# EAGLE design femto (EAGLE 6.4)
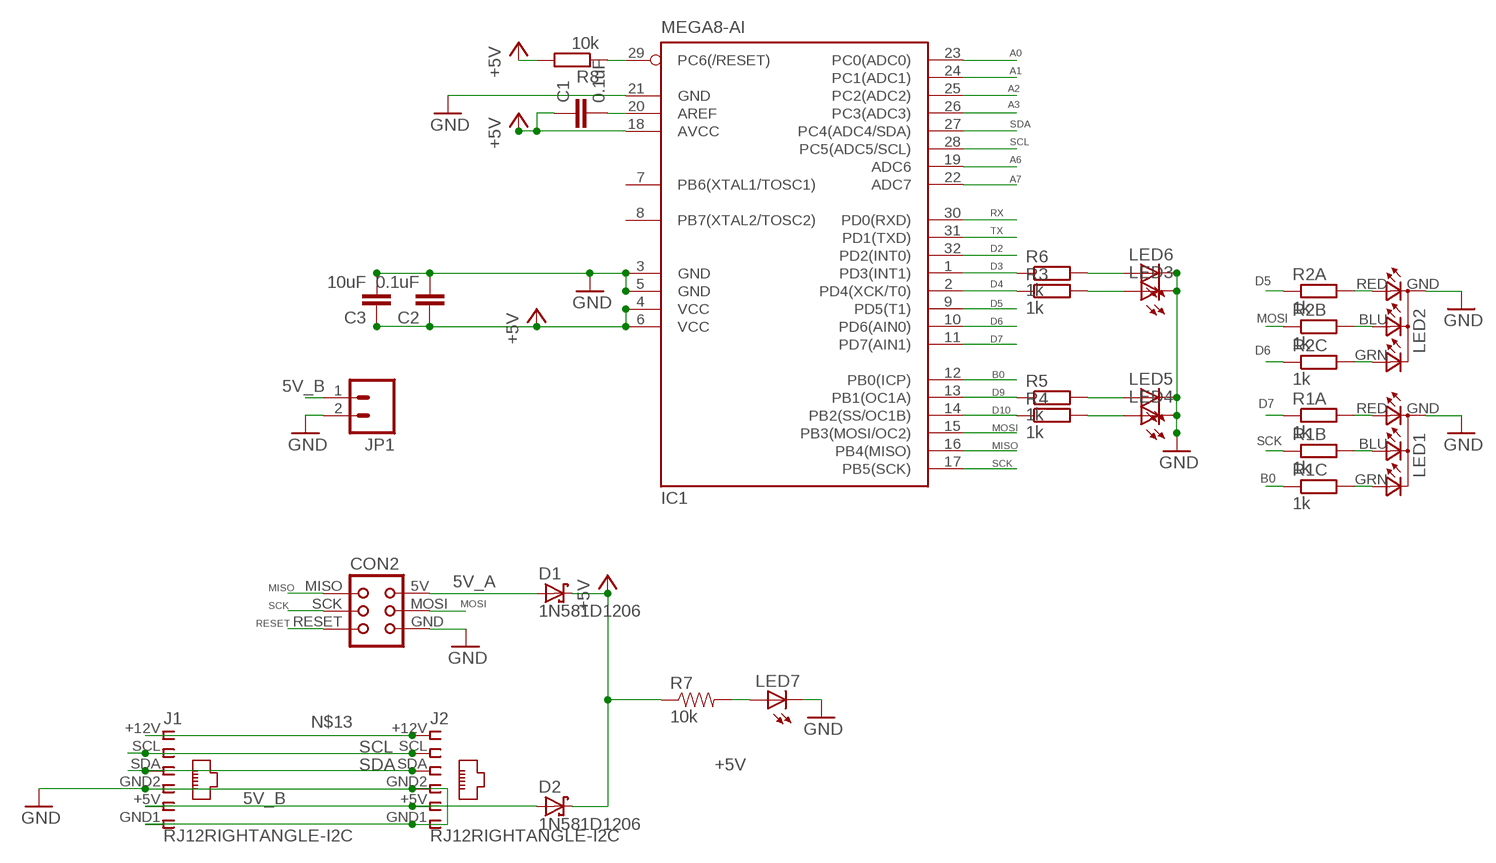
[diagram p0: schematic, sheet 1]

## Parts
C1  0.1uF  C-EUC1206  [C1206]
C2  0.1uF  C-EUC1206  [C1206]
C3  10uF  C-EUC1206  [C1206]
CON2  TINYISPTAG  [TC2030-MCP]
D1  1N581D1206  [LED-1206]
D2  1N581D1206  [LED-1206]
IC1  MEGA8-AI  [TQFP32-08]
J1  RJ12RIGHTANGLE-I2C  [RJ12-RIGHTANGLE-I2C]
J2  RJ12RIGHTANGLE-I2C  [RJ12-RIGHTANGLE-I2C]
JP1  M023.5MM  [SCREWTERMINAL-3.5MM-2]
LED1  RGB-COMMON-CATHODE  [LED-TRICOLOR-THROUGHHOLE]
LED2  RGB-COMMON-CATHODE  [LED-TRICOLOR-THROUGHHOLE]
LED3  LED3MM  [LED3MM]
LED4  LED3MM  [LED3MM]
LED5  LED3MM  [LED3MM]
LED6  LED3MM  [LED3MM]
LED7  LEDCHIP-LED0603  [CHIP-LED0603]
R1A  1k  R-EU_M1206  [M1206]
R1B  1k  R-EU_M1206  [M1206]
R1C  1k  R-EU_M1206  [M1206]
R2A  1k  R-EU_M1206  [M1206]
R2B  1k  R-EU_M1206  [M1206]
R2C  1k  R-EU_M1206  [M1206]
R3  1k  R-EU_M1206  [M1206]
R4  1k  R-EU_M1206  [M1206]
R5  1k  R-EU_M1206  [M1206]
R6  1k  R-EU_M1206  [M1206]
R7  10k  RESISTOR0603-RES  [0603-RES]
R8  10k  R-EU_M1206  [M1206]

## Nets
5V_A [i2c]: CON2.5V(VCC) D1.A
5V_B [power]: D2.A J1.+5V J2.+5V JP1.1
+5V [power]: C1.1 C2.1 C3.1 D1.C D2.C IC1.4(VCC) IC1.6(VCC) IC1.18(AVCC) R7.1 R8.2
A0: IC1.23(PC0(ADC0))
A1: IC1.24(PC1(ADC1))
A2: IC1.25(PC2(ADC2))
A3: IC1.26(PC3(ADC3))
A6: IC1.19(ADC6)
A7: IC1.22(ADC7)
B0: IC1.12(PB0(ICP)) R1C.1
D2: IC1.32(PD2(INT0))
D3: IC1.1(PD3(INT1)) R6.1
D4: IC1.2(PD4(XCK/T0)) R3.1
D5: IC1.9(PD5(T1)) R2A.1
D6: IC1.10(PD6(AIN0)) R2C.1
D7: IC1.11(PD7(AIN1)) R1A.1
D9: IC1.13(PB1(OC1A)) R5.1
D10: IC1.14(PB2(SS/OC1B)) R4.1
GND [power]: C2.2 C3.2 CON2.GND IC1.3(GND) IC1.5(GND) IC1.21(GND) J1.GND1 J1.GND2 J2.GND1 J2.GND2 JP1.2 LED1.GND(A2) LED2.GND(A2) LED3.K(C) LED4.K(C) LED5.K(C) LED6.K(C) LED7.C
MISO: CON2.MISO IC1.16(PB4(MISO))
MOSI: CON2.MOSI IC1.15(PB3(MOSI/OC2)) R2B.1
N$1: LED2.RED(CRED) R2A.2
N$4: C1.2 IC1.20(AREF)
N$7: LED2.BLU(CBLUE) R2B.2
N$8: LED2.GRN(CGREEN) R2C.2
N$13: J1.+12V J2.+12V
N$15: LED7.A R7.2
N$16: LED3.A R3.2
N$20: LED1.RED(CRED) R1A.2
N$21: LED1.BLU(CBLUE) R1B.2
N$22: LED1.GRN(CGREEN) R1C.2
N$23: LED6.A R6.2
N$40: LED5.A R5.2
N$41: LED4.A R4.2
RESET: CON2.RESET IC1.29(PC6(/RESET)) R8.1
RX: IC1.30(PD0(RXD))
SCK: CON2.SCK IC1.17(PB5(SCK)) R1B.1
SCL [i2c]: IC1.28(PC5(ADC5/SCL)) J1.SCL J2.SCL
SDA [i2c]: IC1.27(PC4(ADC4/SDA)) J1.SDA J2.SDA
TX: IC1.31(PD1(TXD))
Unconnected: IC1.7(PB6(XTAL1/TOSC1)) IC1.8(PB7(XTAL2/TOSC2))

## Library data of the parts
C1-C3 = resistor:C-EU: CAPACITOR, European symbol
CON2 = lpatiny:TINYISP: CONNECTOR
D1 D2 = lpatiny:1N581*: 1.0A SCHOTTKY BARRIER RECTIFIER Source: http://www.diodes.com/datasheets/ds23001.pdf
IC1 = atmel:MEGA8: MICROCONTROLLER 8 Kbytes FLASH, 1 kbytes SRAM, 512 bytes EEPROM, USART, 6-channel 10 bit ADC, 2-channel 8 bit ADC Pin compatible with Atmega48, ATMega88, ATMega168 Source: avr.lbr; MPN: ATMEGA8-16AU; OC_FARNELL: 9171371; OC_NEWARK: 73M8863
J1 J2 = lpatiny:RJ12: CORCOM Modular RJ Jacks No Shield Source: www.tycoelectronics.com .. ENG_DS_1654001_1099_RJ_L_0507.pdf
JP1 = SparkFun:M02: Header 2 Standard 2-pin 0.1" header. Use with straight break away headers (SKU : PRT-00116), right angle break away headers (PRT-00553), swiss pins (PRT-00743), machine pins (PRT-00117), and female headers (PRT-00115). Molex polarized connector foot print use with SKU : PRT-08233 with associated crimp pins and housings.
LED1 LED2 = lpatiny:RGB-COMMON-CATHODE
LED3-LED6 = lpatiny:LED3MM
LED7 = adafruit:LED: LED OSRAM: - CHIPLED LG R971, LG N971, LY N971, LG Q971, LY Q971, LO R971, LY R971 LH N974, LH R974 LS Q976, LO Q976, LY Q976 LO Q996 - Hyper CHIPLED LW Q18S LB Q993, LB Q99A, LB R99A - SideLED LS A670, LO A670, LY A670, LG A670, LP A670 LB A673, LV A673, LT A673, LW A673 LH A674 LY A675 LS A676, LA A676, LO A676, LY A676, LW A676 LS A679, LY A679, LG A679 - Hyper Micro SIDELED® LS Y876, LA Y876, LO Y876, LY Y876 LT Y87S - SmartLED LW L88C, LW L88S LB L89C, LB L89S, LG L890 LS L89K, LO L89K, LY L89K LS L896, LA L896, LO L896, LY L896 - TOPLED LS T670, LO T670, LY T670, LG T670, LP T670 LSG T670, LSP T670, LSY T670, LOP T670, LYG T670 LG T671, LOG T671, LSG T671 LB T673, LV T673, LT T673, LW T673 LH T674 LS T676, LA T676, LO T676, LY T676, LB T676, LH T676, LSB T676, LW T676 LB T67C, LV T67C, LT T67C, LS T67K, LO T67K, LY T67K, LW E67C LS E67B, LA E67B, LO E67B, LY E67B, LB E67C, LV E67C, LT E67C LW T67C LS T679, LY T679, LG T679 LS T770, LO T770, LY T770, LG T770, LP T770 LB T773, LV T773, LT T773, LW T773 LH T774 LS E675, LA E675, LY E675, LS T675 LS T776, LA T776, LO T776, LY T776, LB T776 LHGB T686 LT T68C, LB T68C - Hyper Mini TOPLED® LB M676 - Mini TOPLED Santana® LG M470 LS M47K, LO M47K, LY M47K Source: http://www.osram.convergy.de/
R1A R1B R1C R2A R2B R2C R3-R6 R8 = resistor:R-EU_: RESISTOR, European symbol
R7 = SparkFun:RESISTOR: Resistor Basic schematic elements and footprints for 0603, 1206, and PTH resistors.

## Net classes
0 default: width 0.203 mm
1 power: width 0.457 mm
2 i2c: width 0.305 mm
3 fine: width 0.305 mm

## Board
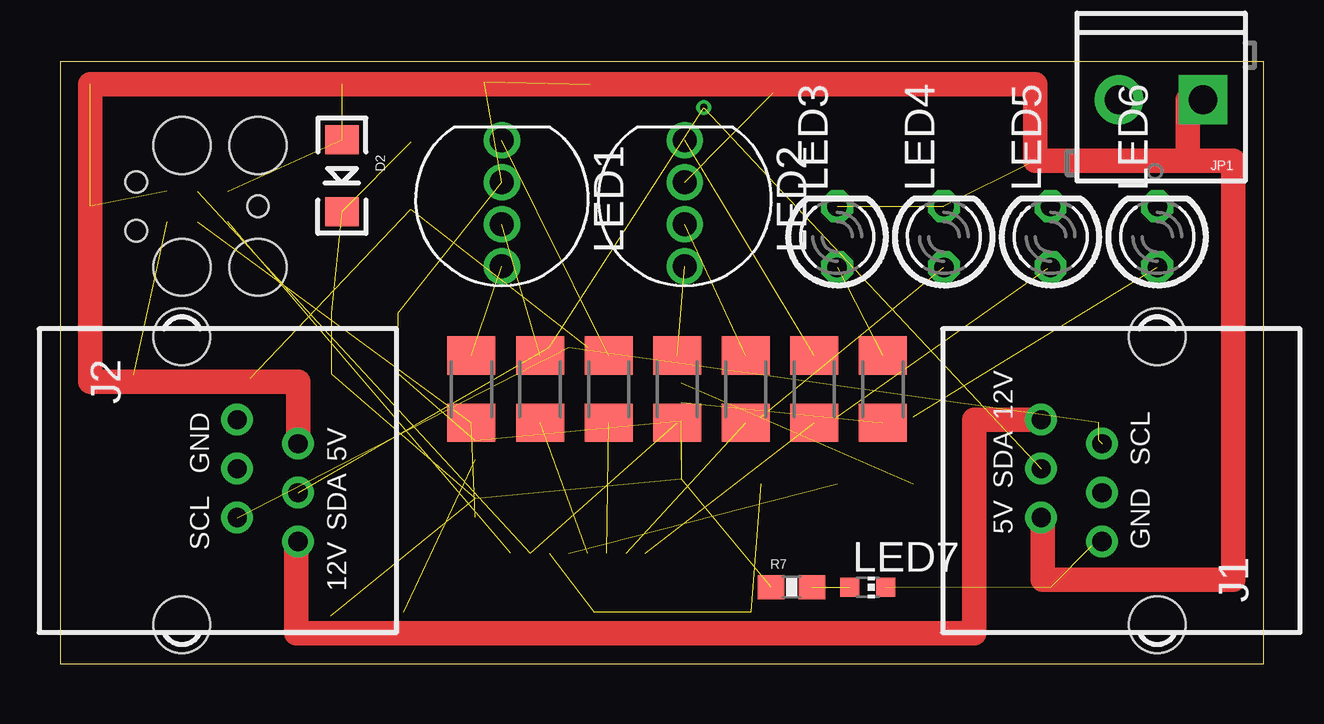
[diagram p1: board, top side]
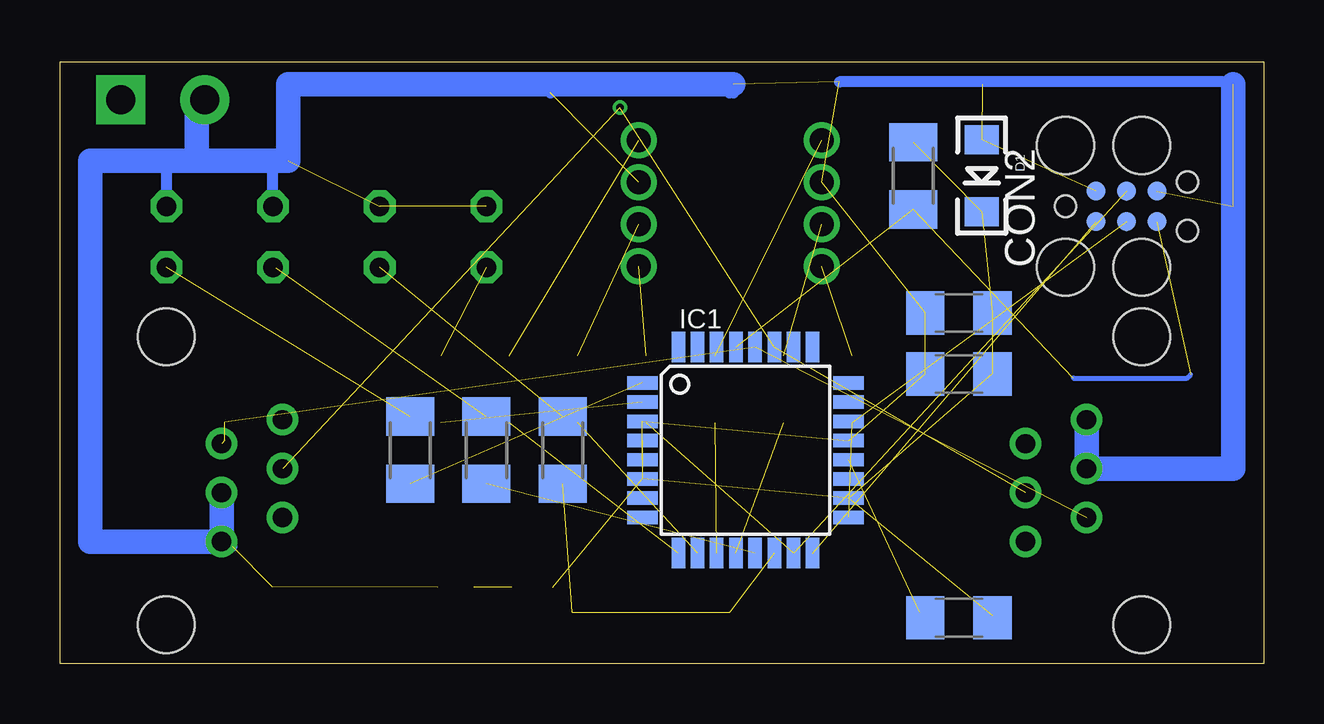
[diagram p2: board, bottom side, seen from below]

Size 50.15 x 25.07 mm. Coordinates in mm from the lower left corner, seen from the top.
Outline: 0,0 50.15,0 50.15,25.07 0,25.07 0,0
Copper layers (1*16): Top 0.035mm / dielectric 1.5mm / Bottom 0.035mm
Design rules: minimum track width 6mil, minimum drill 12mil, track to track 6mil, track to pad 6mil, pad to pad 6mil, via to via 6mil, smd to smd 0mil, copper to edge 10mil, drill to drill 10mil, minimum pad ring 10mil, minimum via ring 6mil, stop-mask expansion 2mil, vias tented up to drill 100mil, thermal gap 10mil
vRestrict: area 15.2,2.5 to 19.1,15.2; area 24.1,2.5 to 27.9,15.2; area 15.2,2.5 to 27.9,6.4; area 15.2,11.4 to 27.9,15.2; area 2.5,16.5 to 7.6,21.6

### Footprints (pad centres in the part's own frame; a part is rotated, then mirrored left to right if it is on the bottom)
C1206 = smd 1.6 x 1.8: 1 -1.4,0; 2 1.4,0
TC2030-MCP = smd 0.787 x 0.787: 5V 1.27,0.635; GND 3.81,0.635; MISO 1.27,-0.635; MOSI 2.54,0.635; RESET 3.81,-0.635; SCK 2.54,-0.635 | hole 0.889: 0,0; 5.08,-1.016; 5.08,1.016 | hole 2.375: 0,2.54; 0,-2.54; 3.175,-2.54; 3.175,2.54
LED-1206 = smd 1.2 x 1.4: A -1.5,0; C 1.5,0
TQFP32-08 = smd 1.27 x 0.559: 1 -4.293,2.8; 2 -4.293,2; 3 -4.293,1.2; 4 -4.293,0.4; 5 -4.293,-0.4; 6 -4.293,-1.2; 7 -4.293,-2; 8 -4.293,-2.8; 17 4.293,-2.8; 18 4.293,-2; 19 4.293,-1.2; 20 4.293,-0.4; 21 4.293,0.4; 22 4.293,1.2; 23 4.293,2; 24 4.293,2.8 | smd 0.559 x 1.27: 9 -2.8,-4.293; 10 -2,-4.293; 11 -1.2,-4.293; 12 -0.4,-4.293; 13 0.4,-4.293; 14 1.2,-4.293; 15 2,-4.293; 16 2.8,-4.293; 25 2.8,4.293; 26 2,4.293; 27 1.2,4.293; 28 0.4,4.293; 29 -0.4,4.293; 30 -1.2,4.293; 31 -2,4.293; 32 -2.8,4.293
RJ12-RIGHTANGLE-I2C = drill 0.8 pad 1.3: +5V -1.54,4.84; +12V 2.54,4.84; GND1 -2.54,2.3; GND2 -0.5,2.3; SCL 1.54,2.3; SDA 0.5,4.84 | hole 2.36: -6,0; 6,0
SCREWTERMINAL-3.5MM-2 = drill 1.2 pad 2.032 square: 1 0,0 | drill 1.2 pad 2.032: 2 3.5,0
LED-TRICOLOR-THROUGHHOLE = drill 1: BLU 2.492,0; GND -1,0; GRN 0.746,0; RED -2.746,0
LED3MM = drill 0.813 octagon: A -1.27,0; K 1.27,0
CHIP-LED0603 = smd 0.8 x 0.8: A 0,-0.75; C 0,0.75
M1206 = smd 1.6 x 2: 1 -1.4,0; 2 1.4,0
0603-RES = smd 1.1 x 1: 1 -0.85,0; 2 0.85,0

### Placement (x,y rotation side)
C1  12.7,1.91 180 bottom
C2  12.7,12.06 180 bottom
C3  12.7,14.61 180 bottom
CON2  8.26,19.05 0 bottom
D1  11.75,20.32 270 bottom
D2  11.75,20.32 270 top
IC1  21.59,8.89 0 bottom
J1  45.72,7.62 90 top
J2  5.08,7.62 270 top
JP1  47.62,23.5 180 top
LED1  18.41,19.05 270 top
LED2  26.04,19.05 270 top
LED3  32.38,17.78 90 top
LED4  36.83,17.78 90 top
LED5  41.27,17.78 90 top
LED6  45.72,17.78 90 top
LED7  33.66,3.17 270 top
R1A  22.86,11.43 90 top
R1B  17.14,11.43 90 top
R1C  20,11.43 90 top
R2A  31.43,11.43 90 top
R2B  25.72,11.43 90 top
R2C  28.57,11.43 90 top
R3  34.29,11.43 90 top
R4  29.21,8.89 90 bottom
R5  32.38,8.89 90 bottom
R6  35.56,8.89 90 bottom
R7  30.48,3.17 0 top
R8  14.61,20.32 90 bottom

### Tracks (layer width: path | path; a pad name or v marks a point on that pad's centre or on a via)
5V_A  (1 unrouted)
5V_B  (1 unrouted)
  Top 1.016: 46.99,20.95 48.9,20.95 48.9,3.49 40.96,3.49 40.96,6.08 J1.+5V | 46.99,20.95 40.64,20.95 40.64,24.13 11.73,24.13 1.27,24.13 1.27,11.75 9.92,11.75 J2.+5V | JP1.1 46.99,23.5 46.99,20.95
+5V  (9 unrouted)
  Bottom 0.457: 11.28,1.98 C1.1
B0  (1 unrouted)
D3  (1 unrouted)
D4  (1 unrouted)
D5  (1 unrouted)
D6  (1 unrouted)
D7  (1 unrouted)
D9  (1 unrouted)
D10  (3 unrouted)
GND  (14 unrouted)
  Bottom 0.457: 42.98,4.88 J1.GND1 | 41.3,20.95 41.3,19.05 LED5.K | 45.72,20.95 LED6.K | 22.1,23.77 22.1,24.13 | 29.72,23.77 29.72,24.13 | 22.25,23.77 22.25,24.13 | 17.68,24.23 1.68,24.23 1.27,24.13
  Bottom 1.016: 44.45,20.95 45.72,20.95 48.9,20.95 48.9,5.08 J1.GND1 J1.GND2 | 44.45,20.95 41.3,20.95 40.64,20.95 40.64,24.13 29.72,24.13 22.25,24.13 22.1,24.13 | JP1.2 44.45,23.5 44.45,20.95 | 1.27,24.13 1.27,8.12 J2.GND2 J2.GND1
MISO  (1 unrouted)
MOSI  (2 unrouted)
N$1  (1 unrouted)
N$4  (1 unrouted)
  Bottom 0.203: 14.33,2.13 14.17,1.98 C1.2
N$7  (1 unrouted)
N$8  (1 unrouted)
N$13
  Top 1.016: J2.+12V 9.84,5.08 9.84,1.27 38.1,1.27 38.1,10.16 J1.+12V
N$15  (1 unrouted)
N$16  (1 unrouted)
N$20  (1 unrouted)
N$21  (1 unrouted)
N$22  (1 unrouted)
N$23  (1 unrouted)
N$40  (1 unrouted)
  Top 0.203: 41.15,16.46 LED5.A
N$41  (1 unrouted)
RESET  (3 unrouted)
  Bottom 0.203: 3.05,12.04 3.2,11.89 7.92,11.89
SCK  (2 unrouted)
SCL  (4 unrouted)
SDA  (via drill 0.3)  (3 unrouted)
  other vias: 26.82,23.16